# Altium schematic sheet Block Diagram.SchDoc
size A3; SheetNumber: 1; SheetTotal: 1
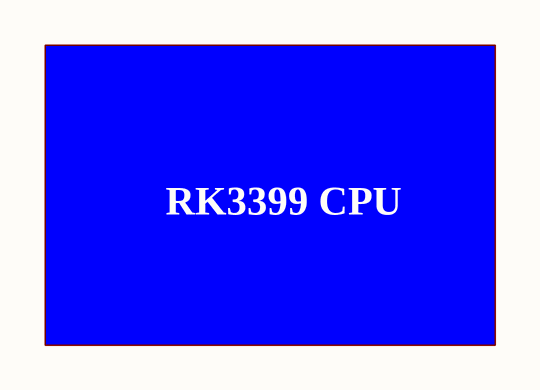
[diagram p0: Block Diagram.SchDoc]

## Notes on the sheet
- RK3399 CPU